# EAGLE schematic PIC32 (EAGLE 9.3.0)
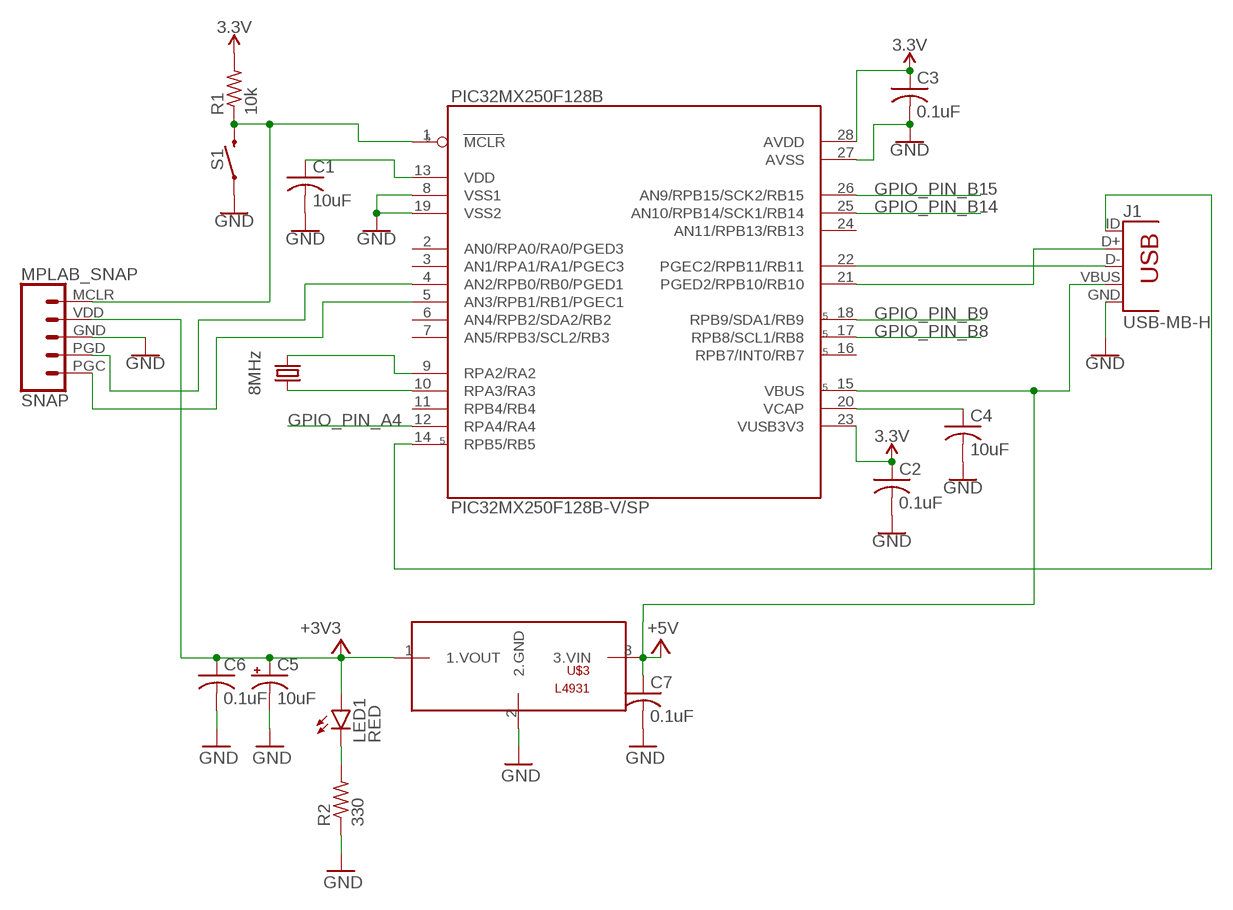
[diagram p0: schematic, sheet 1]

## Parts
C1  10uF  C-US025-024X044  [C025-024X044]
C2  0.1uF  C-US025-024X044  [C025-024X044]
C3  0.1uF  C-US025-024X044  [C025-024X044]
C4  10uF  C-US025-024X044  [C025-024X044]
C5  10uF  CPOL-USB45181B  [B45181B]
C6  0.1uF  C-US025-025X050  [C025-025X050]
C7  0.1uF  C-US025-025X050  [C025-025X050]
J1  USB-MB-H  [USB-MB-H]
LED1  RED  TLLR4400  [LED3MM]
MPLAB_SNAP  SNAP  [SNAP]
PIC32MX250F128B  PIC32MX250F128B-V/SP  [DIP254P762X508-28]
R1  10k  R-US_0204/2V  [0204V]
R2  330  R-US_0207/10  [0207/10]
S1  MOMENTARY-SWITCH-SPST-PTH-6.0MM  [TACTILE_SWITCH_PTH_6.0MM]
U$3  L4931  [TO92-LINE]
Y1  8MHz  CRYSTAL-8MHZSMD-HC49UP  [HC49UP]

## Nets
+3V3: C5.+ C6.1 LED1.A MPLAB_SNAP.VDD U$3.1(1.VOUT)
GND: C1.2 C2.2 C3.2 C4.2 C5.- C6.2 C7.2 J1.GND MPLAB_SNAP.GND PIC32MX250F128B.8(VSS1) PIC32MX250F128B.19(VSS2) PIC32MX250F128B.27(AVSS) R2.1 S1.1 U$3.2(2.GND)
GPIO_PIN_A4: PIC32MX250F128B.12(RPA4/RA4)
GPIO_PIN_B8: PIC32MX250F128B.17(RPB8/SCL1/RB8)
GPIO_PIN_B9: PIC32MX250F128B.18(RPB9/SDA1/RB9)
GPIO_PIN_B14: PIC32MX250F128B.25(AN10/RPB14/SCK1/RB14)
GPIO_PIN_B15: PIC32MX250F128B.26(AN9/RPB15/SCK2/RB15)
N$1: C1.1 PIC32MX250F128B.13(VDD)
N$2: MPLAB_SNAP.MCLR PIC32MX250F128B.1(MCLR) R1.1 S1.3
N$3: MPLAB_SNAP.PGC PIC32MX250F128B.5(AN3/RPB1/RB1/PGEC1)
N$4: C4.1 PIC32MX250F128B.20(VCAP)
N$5: PIC32MX250F128B.9(RPA2/RA2) Y1.2
N$6: PIC32MX250F128B.10(RPA3/RA3) Y1.1
N$8: MPLAB_SNAP.PGD PIC32MX250F128B.4(AN2/RPB0/RB0/PGED1)
N$9: J1.D- PIC32MX250F128B.22(PGEC2/RPB11/RB11)
N$10: J1.D+ PIC32MX250F128B.21(PGED2/RPB10/RB10)
N$11: J1.ID PIC32MX250F128B.14(RPB5/RB5)
N$12: LED1.K(C) R2.2
N$13: C7.1 J1.VBUS PIC32MX250F128B.15(VBUS) U$3.3(3.VIN) ; supply symbol labelled +5V
VCC: C2.1 C3.1 PIC32MX250F128B.23(VUSB3V3) PIC32MX250F128B.28(AVDD) R1.2 ; supply symbol labelled 3.3V
Unconnected: PIC32MX250F128B.2(AN0/RPA0/RA0/PGED3) PIC32MX250F128B.3(AN1/RPA1/RA1/PGEC3) PIC32MX250F128B.6(AN4/RPB2/SDA2/RB2) PIC32MX250F128B.7(AN5/RPB3/SCL2/RB3) PIC32MX250F128B.11(RPB4/RB4) PIC32MX250F128B.16(RPB7/INT0/RB7) PIC32MX250F128B.24(AN11/RPB13/RB13)

## Library data of the parts
C1-C4 C6 C7 = PIC32_parts:C-US: CAPACITOR, American symbol; SPICEPREFIX: C
C5 = PIC32_parts:CPOL-US: POLARIZED CAPACITOR, American symbol; SPICEPREFIX: C
J1 = PIC32_parts:USB: USB Connectors USB-B-PTH is fully proven SKU : PRT-00139/CONN-08278 USB-miniB is fully proven SKU : PRT-00587 USB-A-PCB is untested. USB-A-H is throughly reviewed, but untested. Spark Fun Electronics SKU : PRT-00437 USB-B-SMT is throughly reviewed, but untested. Needs silkscreen touching up. USB-A-S has not been used/tested USB-MB-H has not been used/tested USB-MICROB has been used. CONN-09505
LED1 = led:TLLR4400: Low Current (2mA) LED 3 mm Tinted Diffused Package color RED Source: Data sheet <http://www.farnell.com/datasheets/391100.pdf>; MF: VISHAY SEMICONDUCTOR; OC_FARNELL: 1612437
MPLAB_SNAP = PIC32_parts:SNAP
PIC32MX250F128B = PIC32MX250F128B-V_SP:PIC32MX250F128B-V/SP; AVAILABILITY: Unavailable; DESCRIPTION: 32 Bit MCU, 128KB Flash, 32KB RAM, 40 MHz, 28 Pin, 3 Comp, CTMU, RTCC, 28 SPDIP; MF: Microchip; MP: PIC32MX250F128B-V/SP; PACKAGE: SPDIP-28 Microchip; PRICE: None
R1 R2 = PIC32_parts:R-US_: RESISTOR, American symbol; SPICEPREFIX: R
S1 = SparkFun-Switches:MOMENTARY-SWITCH-SPST: Momentary Switch (Pushbutton) - SPST Normally-open (NO) SPST momentary switches (buttons, pushbuttons). Variants PTH-12MM - 12mm square, through-hole Momentary Pushbutton Switch - 12mm Square <https://www.sparkfun.com/products/9190> (COM-09190) PTH-6.0MM, PTH-6.0MM-KIT - 6.0mm square, through-hole Mini Pushbutton Switch <https://www.sparkfun.com/products/97> (COM-00097) KIT package intended for soldering kit's - only one side of pads' copper is exposed. PTH-RIGHT-ANGLE-KIT - Right-angle, through-hole Right Angle Tactile Button <https://www.sparkfun.com/products/10791> - Used on SparkFun BigTime Watch Kit <https://www.sparkfun.com/products/11734> SMD-12MM - 12mm square, surface-mount Tactile Button - SMD (12mm) <https://www.sparkfun.com/products/12993> (COM-12993) Used on SparkFun PicoBoard <https://www.sparkfun.com/products/11888> SMD-4.5MM - 4.5mm Square Trackball Switch Used on SparkFun Blackberry Trackballer Breakout <https://www.sparkfun.com/products/13169> SMD-4.6MMX2.8MM - 4.60mm x 2.80mm, surface mount Used on SparkFun SAMD21 Mini Breakout <https://www.sparkfun.com/products/13664> SMD-5.2MM, SMD-5.2-REDUNDANT - 5.2mm square, surface-mount Mini Pushbutton Switch - SMD <https://www.sparkfun.com/products/8720> (COM-08720) Used on Arduino Pro Mini <https://www.sparkfun.com/products/11114> REDUNDANT package connects both switch circuits together SMD-6.0X3.5MM - 6.0 x 3.5mm, surface mount Momentary Reset Switch SMD <https://www.sparkfun.com/products/8229> (COM-08229) SMD-6.2MM-TALL - 6.2mm square, surface mount Tactile Button - SMD (6mm) <https://www.sparkfun.com/products/12992> Used on SparkFun Digital Sandbox <https://www.sparkfun.com/products/12651> SMD-RIGHT-ANGLE - Right-angle, surface mount Used on SparkFun Block for Intel® Edison - Arduino <https://www.sparkfun.com/products/13036>; PROD_ID: SWCH-08441; SF_SKU: COM-00097
U$3 = PIC32_parts:L4931
Y1 = SparkFun-Clocks:CRYSTAL-8MHZ: 8MHz Crystal Datasheet Example <http://www.futureelectronics.com/en/technologies/electromechanical/timing-devices/crystals/Pages/6008189-ABM3B-8.000MHZ-B2-T.aspx?IM=0> Frequency: 8MHz Frequency Tolerance: ±20ppm Load Capacitance: 18pF SparkFun Products: Pro Micro -3.3V/8MHz <https://www.sparkfun.com/products/12587> WAV Trigger <https://www.sparkfun.com/products/13660>; PROD_ID: XTAL-11706